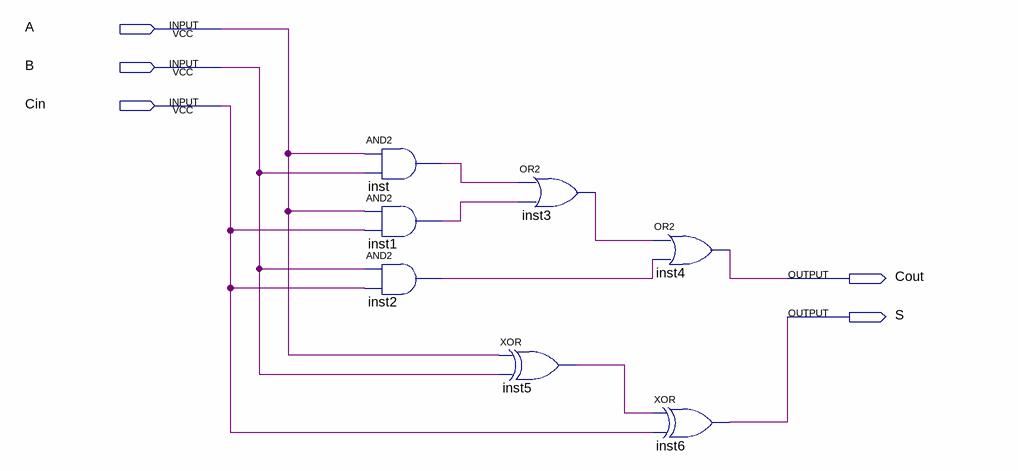
[diagram p0: schematic sheet]
// Quartus schematic lab3.bdf as structural Verilog: 7 symbols, 5 pins
module lab3 (
  input  A,
  input  B,
  input  Cin,
  output Cout,
  output S
);

  wire inst1_out, inst2_out, inst3_out, inst5_out, inst_out;

  and inst (inst_out, A, B);
  and inst1 (inst1_out, A, Cin);
  and inst2 (inst2_out, B, Cin);
  or inst3 (inst3_out, inst_out, inst1_out);
  xor inst5 (inst5_out, A, B);
  or inst4 (Cout, inst3_out, inst2_out);
  xor inst6 (S, inst5_out, Cin);
endmodule
